# Altium schematic sheet MotorDriver.SchDoc
size A4
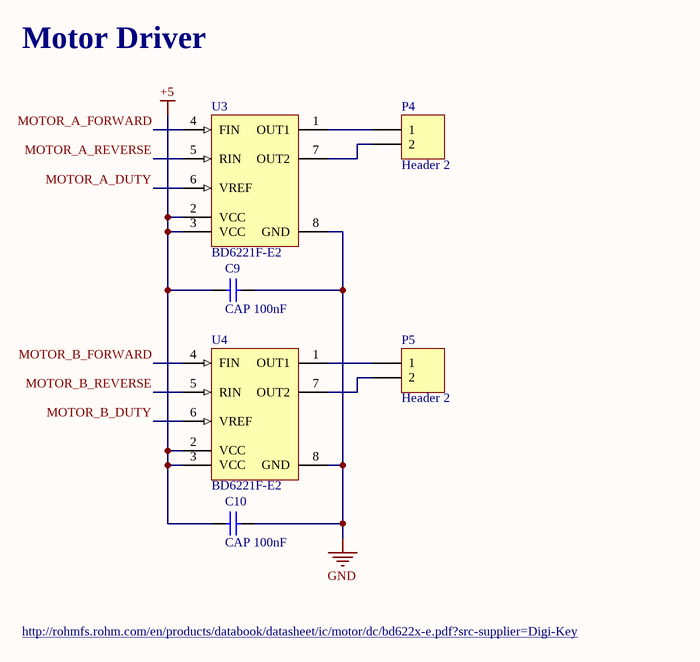
[diagram p0: MotorDriver.SchDoc]

## Parts
C9  CAP 100nF  [CAPC0603(1608)100_M]
C10  CAP 100nF  [CAPC0603(1608)100_M]
P4  Header 2  [HDR1X2]
P5  Header 2  [HDR1X2]
U3  BD6221F-E2  [ROHM-SOP-8_V]
U4  BD6221F-E2  [ROHM-SOP-8_V]

## Nets
+5: C9.2 C10.2 U3.2(VCC) U3.3(VCC) U4.2(VCC) U4.3(VCC)
GND: C9.1 C10.1 U3.8(GND) U4.8(GND)
MOTOR_A_DUTY: U3.6(VREF)
MOTOR_A_FORWARD: U3.4(FIN)
MOTOR_A_REVERSE: U3.5(RIN)
MOTOR_B_DUTY: U4.6(VREF)
MOTOR_B_FORWARD: U4.4(FIN)
MOTOR_B_REVERSE: U4.5(RIN)
NetP4_1: P4.1 U3.1(OUT1)
NetP4_2: P4.2 U3.7(OUT2)
NetP5_1: P5.1 U4.1(OUT1)
NetP5_2: P5.2 U4.7(OUT2)

## Notes on the sheet
- Motor Driver
- http://rohmfs.rohm.com/en/products/databook/datasheet/ic/motor/dc/bd622x-e.pdf?src-supplier=Digi-Key

## Library data of the parts
C9 C10 = CMP-1035-02583-1: CAP 100nF 16V ±5% 0603 (1608 Metric) Thickness 1mm SMD; Tolerance: Â±5%; Case-Metric: 1608; Case-EIA: 0603; Rated Voltage: 16 V; Max Thickness: 1 mm; Technology: SMT; Value: 100nF
P4 P5 = Header 2: Header, 2-Pin; LatestRevisionDate: 17-Jul-2002; LatestRevisionNote: Re-released for DXP Platform.; Publisher: Altium Limited
U3 U4 = CMP-1539-00001-1: DC Brush Motor Driver, 6 to 18 V, 1 A, -40 to 85 degC, 8-Pin SOP, RoHS, Tape and Reel; Manufacturer: ROHM Semiconductor; Supply Voltage: 6 to 15 V; RON@IOUT: 0.5 A=1.5 Ohm Typ.; Output Current: 1 A Max.; ComponentLink1URL: http://www.rohm.com/web/global/; Mounting Technology: Surface Mount; DatasheetVersion: Rev. 003; ComponentLink2Description: Datasheet; RoHS: TRUE; ComponentLink3URL: http://rohmfs.rohm.com/en/products/databook/package/spec/ic/sop-1-2-e.pdf; ComponentLink1Description: Manufacturer URL; PartNumber: BD6221F-E2; PackageDescription: 8-Pin Small Outline Package, Body 5 x 4.4 mm, Pitch 1.27 mm; ComponentLink3Description: Package Specification; ComponentLink2URL: http://rohmfs.rohm.com/en/products/databook/datasheet/ic/motor/dc/bd622x-e.pdf; Temperature Range: -40 to 85 degC; PackageVersion: Rev. A; Packing: Tape and Reel